# Altium schematic sheet chess_module_LEDs.SchDoc
size A; SheetNumber: 1; SheetTotal: 3
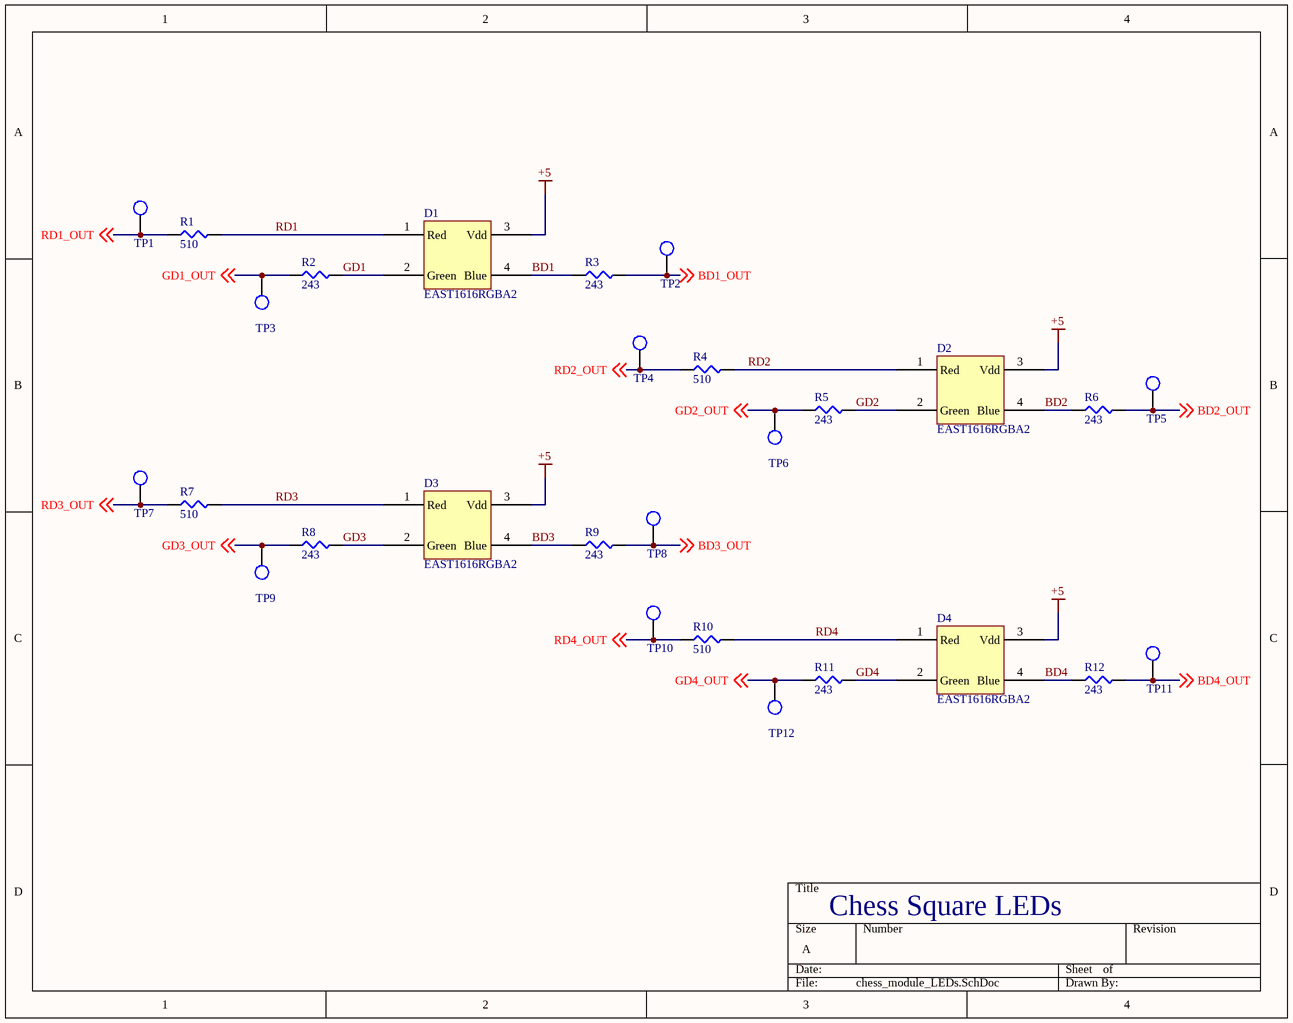
[diagram p0: chess_module_LEDs.SchDoc]

## Parts
D1  EAST1616RGBA2  [EAST1616RGBA2]
D2  EAST1616RGBA2  [EAST1616RGBA2]
D3  EAST1616RGBA2  [EAST1616RGBA2]
D4  EAST1616RGBA2  [EAST1616RGBA2]
R1  510  [SMD-0805-RES]
R2  243  [SMD-0805-RES]
R3  243  [SMD-0805-RES]
R4  510  [SMD-0805-RES]
R5  243  [SMD-0805-RES]
R6  243  [SMD-0805-RES]
R7  510  [SMD-0805-RES]
R8  243  [SMD-0805-RES]
R9  243  [SMD-0805-RES]
R10  510  [SMD-0805-RES]
R11  243  [SMD-0805-RES]
R12  243  [SMD-0805-RES]
TP1  TP_1206  [TP-SMC-1206]  (value not drawn)
TP2  TP_1206  [TP-SMC-1206]  (value not drawn)
TP3  TP_1206  [TP-SMC-1206]  (value not drawn)
TP4  TP_1206  [TP-SMC-1206]  (value not drawn)
TP5  TP_1206  [TP-SMC-1206]  (value not drawn)
TP6  TP_1206  [TP-SMC-1206]  (value not drawn)
TP7  TP_1206  [TP-SMC-1206]  (value not drawn)
TP8  TP_1206  [TP-SMC-1206]  (value not drawn)
TP9  TP_1206  [TP-SMC-1206]  (value not drawn)
TP10  TP_1206  [TP-SMC-1206]  (value not drawn)
TP11  TP_1206  [TP-SMC-1206]  (value not drawn)
TP12  TP_1206  [TP-SMC-1206]  (value not drawn)

## Nets
+5: D1.3(Vdd) D2.3(Vdd) D3.3(Vdd) D4.3(Vdd)
BD1: D1.4(Blue) R3.1
BD1_OUT: R3.2 TP2.1 ; off-sheet BD1_OUT
BD2: D2.4(Blue) R6.1
BD2_OUT: R6.2 TP5.1 ; off-sheet BD2_OUT
BD3: D3.4(Blue) R9.1
BD3_OUT: R9.2 TP8.1 ; off-sheet BD3_OUT
BD4: D4.4(Blue) R12.1
BD4_OUT: R12.2 TP11.1 ; off-sheet BD4_OUT
GD1: D1.2(Green) R2.2
GD1_OUT: R2.1 TP3.1 ; off-sheet GD1_OUT
GD2: D2.2(Green) R5.2
GD2_OUT: R5.1 TP6.1 ; off-sheet GD2_OUT
GD3: D3.2(Green) R8.2
GD3_OUT: R8.1 TP9.1 ; off-sheet GD3_OUT
GD4: D4.2(Green) R11.2
GD4_OUT: R11.1 TP12.1 ; off-sheet GD4_OUT
RD1: D1.1(Red) R1.2
RD1_OUT: R1.1 TP1.1 ; off-sheet RD1_OUT
RD2: D2.1(Red) R4.2
RD2_OUT: R4.1 TP4.1 ; off-sheet RD2_OUT
RD3: D3.1(Red) R7.2
RD3_OUT: R7.1 TP7.1 ; off-sheet RD3_OUT
RD4: D4.1(Red) R10.2
RD4_OUT: R10.1 TP10.1 ; off-sheet RD4_OUT

## Notes on the sheet
- Chess Square LEDs

## Library data of the parts
R1 R4 R7 R10 = ERJ-6ENF5100V: RES SMD 510 OHM 1% 1/8W 0805; Manufacturer: Panasonic Electronic Components; Factory Stock: 0; Unit Price (USD): 0.00729; @ qty: 1500; Minimum Quantity: 1; Power (Watts): 0.125W, 1/8W; Temperature Coefficient: ±100ppm/°C; Part Number: ERJ-6ENF5100V; Datasheets: http://industrial.panasonic.com/www-cgi/jvcr13pz.cgi?E+PZ+3+AOA0002+ERJ6ENF5100V+7+WW; Image: //media.digikey.com/Renders/Panasonic%20Renders/ERJ-0805%20Pkg.jpg; Digi-Key Part Number: P510CCT-ND; Quantity Available: 80206; Packaging: Cut Tape (CT); Series: ERJ; Part Status: Active; Value: 510; Tolerance: ±1%; Composition: Thick Film; Features: Automotive AEC-Q200; Operating Temperature: -55°C ~ 155°C; Package / Case: 0805 (2012 Metric); Supplier Device Package: 0805; Size / Dimension: 0.079" L x 0.049" W (2.00mm x 1.25mm); Height - Seated (Max): 0.028" (0.70mm); Number of Terminations: 2; Failure Rate: -
R2 R3 R5 R6 R8 R9 R11 R12 = ERJ-6ENF2430V: RES SMD 243 OHM 1% 1/8W 0805; Manufacturer: Panasonic Electronic Components; Factory Stock: 0; Unit Price (USD): 0.00729; @ qty: 1500; Minimum Quantity: 1; Power (Watts): 0.125W, 1/8W; Temperature Coefficient: ±100ppm/°C; Part Number: ERJ-6ENF2430V; Datasheets: http://industrial.panasonic.com/www-cgi/jvcr13pz.cgi?E+PZ+3+AOA0002+ERJ6ENF2430V+7+WW; Image: //media.digikey.com/Renders/Panasonic%20Renders/ERJ-0805%20Pkg.jpg; Digi-Key Part Number: P243CCT-ND; Quantity Available: 46150; Packaging: Cut Tape (CT); Series: ERJ; Part Status: Active; Value: 243; Tolerance: ±1%; Composition: Thick Film; Features: Automotive AEC-Q200; Operating Temperature: -55°C ~ 155°C; Package / Case: 0805 (2012 Metric); Supplier Device Package: 0805; Size / Dimension: 0.079" L x 0.049" W (2.00mm x 1.25mm); Height - Seated (Max): 0.028" (0.70mm); Number of Terminations: 2; Failure Rate: -
TP1-TP12 = TP_1206: Test Point SMD 1206; Manufacturer: TE Connectivity (Tyco Electronics); Manufacturer Part Number: 1625854-1; Resistance Value: 0 Ohm; Temperature Coefficient: N/R; Supplier: Digi-Key; Stock 1: 31937; Pricing 1: 1=0.28, 10=0.261, 25=0.224, 50=0.1902, 100=0.1828, 250=0.1641, 500=0.1567, 1000=0.1306 (USD); Case Size: 1206; Dimension: 3.2 x 1.6 x 1.25mm; Family: RC; Mounting: Surface Mount; Operating Temperature: -55 to 125 C; Part No: 1625854-1; RoHS: Yes; Packaging: Tape and Reel; Termination Style: N/R; Terminal Pitch: N/R; Power Rating: N/R; Tolerance: N/R; ComponentLink1URL: https://datasheet.ciiva.com/6439/eng-ds-1773266-a-6439169.pdf; ComponentLink1Description: https://datasheet.ciiva.com/6439/eng-ds-1773266-a-6439169.pdf; ComponentLink2URL: https://datasheet.ciiva.com/30136/1773266-a-30136341.pdf; ComponentLink2Description: https://datasheet.ciiva.com/30136/1773266-a-30136341.pdf; ComponentLink3URL: https://datasheet.ciiva.com/6439/eng-ds-1773266-a-6439080.pdf; ComponentLink3Description: https://datasheet.ciiva.com/6439/eng-ds-1773266-a-6439080.pdf; ComponentLink4URL: https://datasheet.ciiva.com/6439/eng-ds-1773266-a-6439081.pdf; ComponentLink4Description: https://datasheet.ciiva.com/6439/eng-ds-1773266-a-6439081.pdf; ComponentLink5URL: https://datasheet.ciiva.com/6439/eng-ds-1773266-a-6439083.pdf; ComponentLink5Description: https://datasheet.ciiva.com/6439/eng-ds-1773266-a-6439083.pdf; Supplier Part Number: A106143CT-ND